# Altium schematic sheet SP3232_module.SchDoc
size A
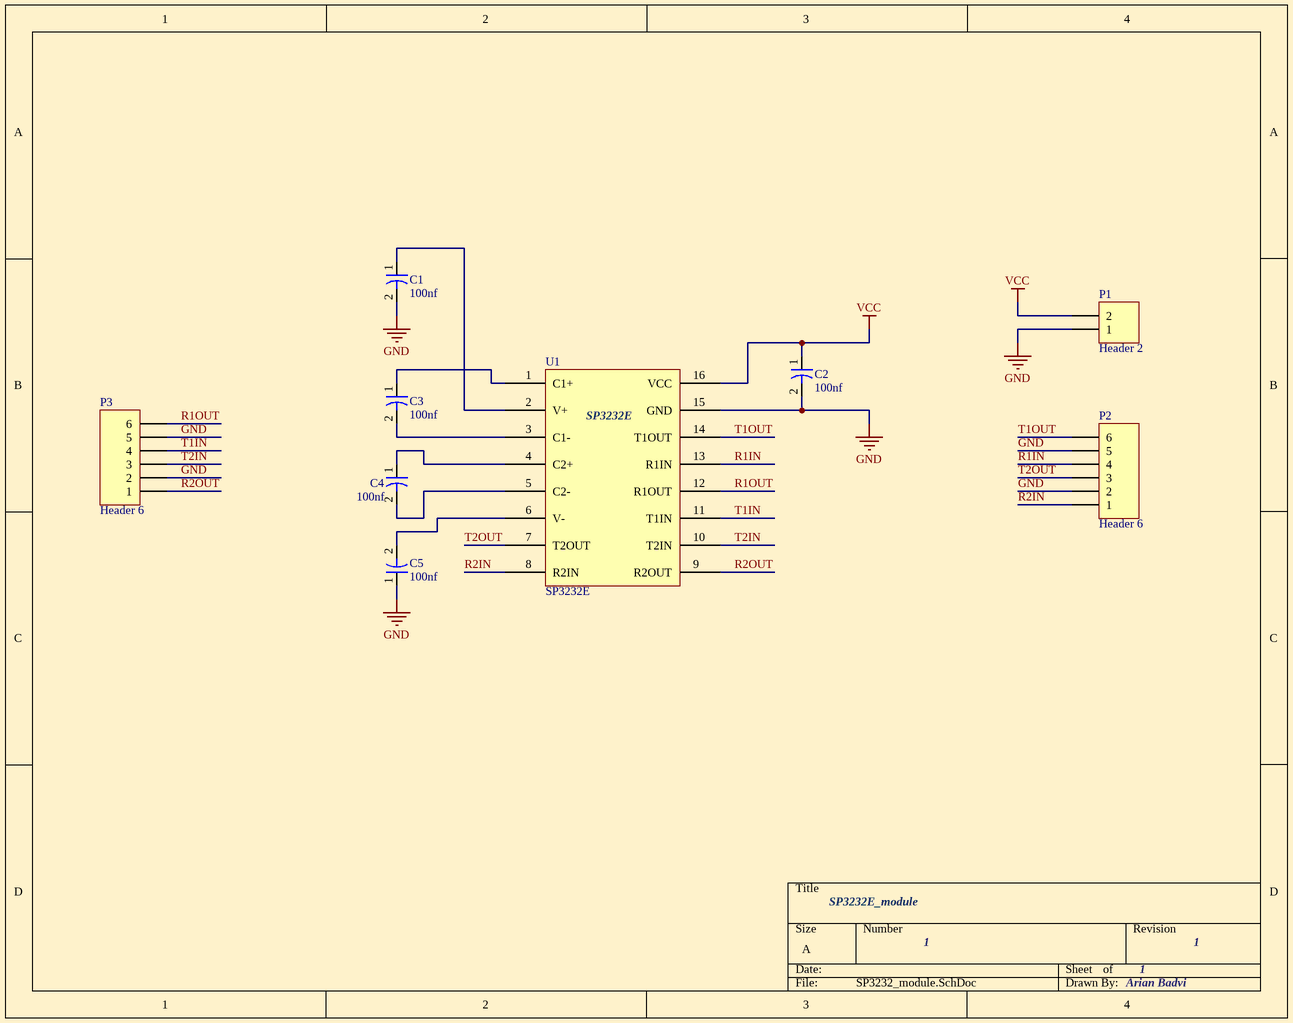
[diagram p0: SP3232_module.SchDoc]

## Parts
C1  100nf  [CAP_SMD_A]
C2  100nf  [CAP_SMD_A]
C3  100nf  [CAP_SMD_A]
C4  100nf  [CAP_SMD_A]
C5  100nf  [CAP_SMD_A]
P1  Header 2  [HDR_M_1X2]
P2  Header 6  [HDR_M_1X6]
P3  Header 6  [HDR_M_1X6]
U1  SP3232E  [so_16_w]

## Nets
GND: C1.2 C2.2 C5.1 P1.1 P2.2 P2.5 P3.2 P3.5 U1.15(GND)
VCC: C2.1 P1.2 U1.16(VCC)
R1IN: P2.4 U1.13(R1IN)
R1OUT: P3.6 U1.12(R1OUT)
R2IN: P2.1 U1.8(R2IN)
R2OUT: P3.1 U1.9(R2OUT)
T1IN: P3.4 U1.11(T1IN)
T1OUT: P2.6 U1.14(T1OUT)
T2IN: P3.3 U1.10(T2IN)
T2OUT: P2.3 U1.7(T2OUT)
NetC1_1: C1.1 U1.2(V+)
NetC3_1: C3.1 U1.1(C1+)
NetC3_2: C3.2 U1.3(C1-)
NetC4_1: C4.1 U1.4(C2+)
NetC4_2: C4.2 U1.5(C2-)
NetC5_2: C5.2 U1.6(V-)

## Notes on the sheet
- SP3232E_module
- 1
- Arian Badvi

## Library data of the parts
C1-C5 = Cap2: Capacitor, pol; Published: 23-Sep-2002; PackageReference: CAPR5-4X5; Publisher: Altium Limited; PackageDescription: Capacitor; 2 Leads; Value: 100nf
P1 = Header 2: Header, 2-Pin; LatestRevisionDate: 17-Jul-2002; LatestRevisionNote: Re-released for DXP Platform.; Publisher: Altium Limited
P2 P3 = Header 6: Header, 6-Pin; LatestRevisionDate: 17-Jul-2002; LatestRevisionNote: Re-released for DXP Platform.; Publisher: Altium Limited
U1 = SP3232E: TTL to RS232 converter and vise versa